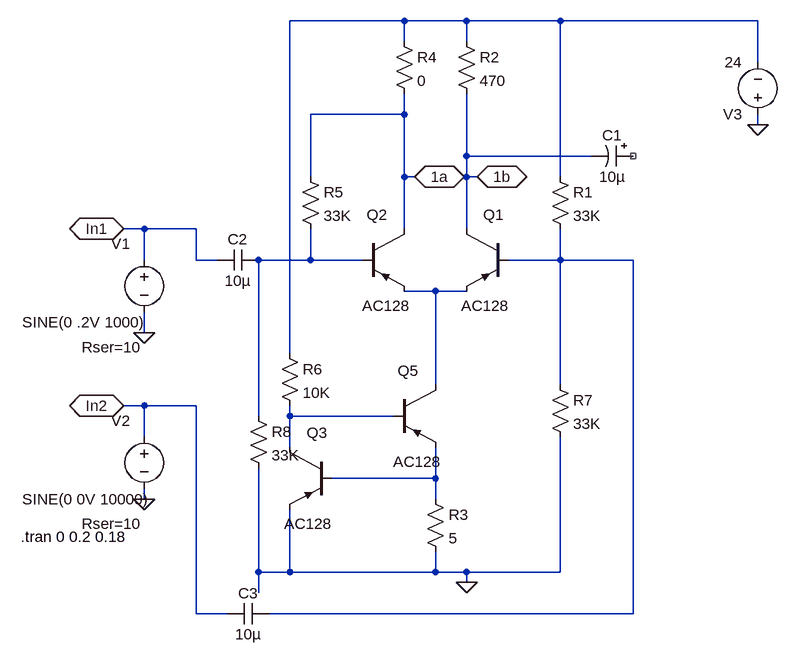
[diagram p0: schematic diff.asc]
diff.asc, the LTspice schematic file:
Version 4
SHEET 1 1060 680
WIRE 480 -464 304 -464
WIRE 576 -464 480 -464
WIRE 720 -464 576 -464
WIRE 1024 -464 720 -464
WIRE 480 -432 480 -464
WIRE 576 -432 576 -464
WIRE 1024 -400 1024 -464
WIRE 480 -320 480 -352
WIRE 480 -320 336 -320
WIRE 1024 -304 1024 -320
WIRE 576 -256 576 -352
WIRE 768 -256 576 -256
WIRE 336 -224 336 -320
WIRE 480 -224 480 -320
WIRE 496 -224 480 -224
WIRE 576 -224 576 -256
WIRE 592 -224 576 -224
WIRE 720 -224 720 -464
WIRE 80 -144 48 -144
WIRE 160 -144 80 -144
WIRE 480 -144 480 -224
WIRE 576 -144 576 -224
WIRE 80 -96 80 -144
WIRE 160 -96 160 -144
WIRE 192 -96 160 -96
WIRE 336 -96 336 -144
WIRE 336 -96 256 -96
WIRE 416 -96 336 -96
WIRE 720 -96 720 -144
WIRE 720 -96 640 -96
WIRE 832 -96 720 -96
WIRE 528 -48 480 -48
WIRE 576 -48 528 -48
WIRE 80 16 80 -16
WIRE 304 48 304 -464
WIRE 528 96 528 -48
WIRE 720 96 720 -96
WIRE 80 128 48 128
WIRE 160 128 80 128
WIRE 256 144 256 -96
WIRE 304 144 304 128
WIRE 464 144 304 144
WIRE 80 176 80 128
WIRE 304 192 304 144
WIRE 528 240 528 192
WIRE 528 240 368 240
WIRE 80 272 80 256
WIRE 528 272 528 240
WIRE 256 384 256 224
WIRE 304 384 304 288
WIRE 304 384 256 384
WIRE 528 384 528 352
WIRE 528 384 304 384
WIRE 576 384 528 384
WIRE 720 384 720 176
WIRE 720 384 576 384
WIRE 576 400 576 384
WIRE 256 416 256 384
WIRE 160 448 160 128
WIRE 208 448 160 448
WIRE 832 448 832 -96
WIRE 832 448 272 448
FLAG 80 16 0
FLAG 48 -144 In1
IOPIN 48 -144 BiDir
FLAG 80 272 0
FLAG 48 128 In2
IOPIN 48 128 BiDir
FLAG 592 -224 1b
IOPIN 592 -224 BiDir
FLAG 496 -224 1a
IOPIN 496 -224 BiDir
FLAG 1024 -304 0
FLAG 576 400 0
SYMBOL voltage 80 -112 R0
WINDOW 39 -96 150 Left 2
WINDOW 3 -188 112 Left 2
WINDOW 0 -51 -9 Left 2
SYMATTR SpiceLine Rser=10
SYMATTR Value SINE(0 .2V 1000)
SYMATTR InstName V1
SYMATTR Value2 AC 1
SYMBOL pnp 640 -144 M0
WINDOW 3 -1 118 Left 2
WINDOW 0 6 -22 Left 2
SYMATTR Value AC128
SYMATTR InstName Q1
SYMBOL res 704 -240 R0
SYMATTR InstName R1
SYMATTR Value 33K
SYMBOL res 560 -448 R0
SYMATTR InstName R2
SYMATTR Value 470
SYMBOL polcap 832 -272 R90
WINDOW 0 0 32 VBottom 2
WINDOW 3 32 32 VTop 2
SYMATTR InstName C1
SYMATTR Value 10µ
SYMATTR Description Capacitor
SYMATTR Type cap
SYMATTR SpiceLine V=16 Irms=85m Rser=1.8 Lser=0
SYMBOL pnp 416 -144 R0
WINDOW 3 -1 118 Left 2
WINDOW 0 6 -22 Left 2
SYMATTR Value AC128
SYMATTR InstName Q2
SYMBOL res 464 -448 R0
SYMATTR InstName R4
SYMATTR Value 0
SYMBOL res 320 -240 R0
SYMATTR InstName R5
SYMATTR Value 33K
SYMBOL cap 256 -112 R90
WINDOW 0 0 32 VBottom 2
WINDOW 3 32 32 VTop 2
SYMATTR InstName C2
SYMATTR Value 10µ
SYMBOL cap 272 432 R90
WINDOW 0 0 32 VBottom 2
WINDOW 3 32 32 VTop 2
SYMATTR InstName C3
SYMATTR Value 10µ
SYMBOL voltage 80 160 R0
WINDOW 39 -96 150 Left 2
WINDOW 3 -188 112 Left 2
WINDOW 0 -51 -9 Left 2
SYMATTR SpiceLine Rser=10
SYMATTR Value SINE(0 0V 10000)
SYMATTR InstName V2
SYMATTR Value2 AC 1
SYMBOL voltage 1024 -304 R180
WINDOW 123 0 0 Left 2
WINDOW 39 24 -12 Left 2
SYMATTR InstName V3
SYMATTR Value 24
SYMBOL pnp 368 192 M0
WINDOW 3 -1 118 Left 2
WINDOW 0 6 -22 Left 2
SYMATTR Value AC128
SYMATTR InstName Q3
SYMBOL pnp 464 96 R0
WINDOW 3 -1 118 Left 2
WINDOW 0 6 -22 Left 2
SYMATTR Value AC128
SYMATTR InstName Q5
SYMBOL res 512 256 R0
SYMATTR InstName R3
SYMATTR Value 5
SYMBOL res 288 32 R0
SYMATTR InstName R6
SYMATTR Value 10K
SYMBOL res 704 80 R0
SYMATTR InstName R7
SYMATTR Value 33K
SYMBOL res 240 128 R0
SYMATTR InstName R8
SYMATTR Value 33K
TEXT -110 330 Left 2 !.tran 0 0.2 0.18

The netlist it stands for:
* diff.asc
V1 In1 0 SINE(0 .2V 1000) AC 1 Rser=10
Q1 1b N003 N004 0 AC128
R1 N001 N003 33K
R2 N001 1b 470
C1 NC_01 1b 10µ V=16 Irms=85m Rser=1.8 Lser=0
Q2 1a N002 N004 0 AC128
R4 N001 1a 0
R5 1a N002 33K
C2 N002 In1 10µ
C3 N003 In2 10µ
V2 In2 0 SINE(0 0V 10000) AC 1 Rser=10
V3 0 N001 24
Q3 N005 N006 0 0 AC128
Q5 N004 N005 N006 0 AC128
R3 N006 0 5
R6 N001 N005 10K
R7 N003 0 33K
R8 N002 0 33K
.model NPN NPN
.model PNP PNP
.lib standard.bjt
.tran 0 0.2 0.18
.backanno
.end